# EAGLE design pov-yoyo-0.1 (EAGLE 5.11)
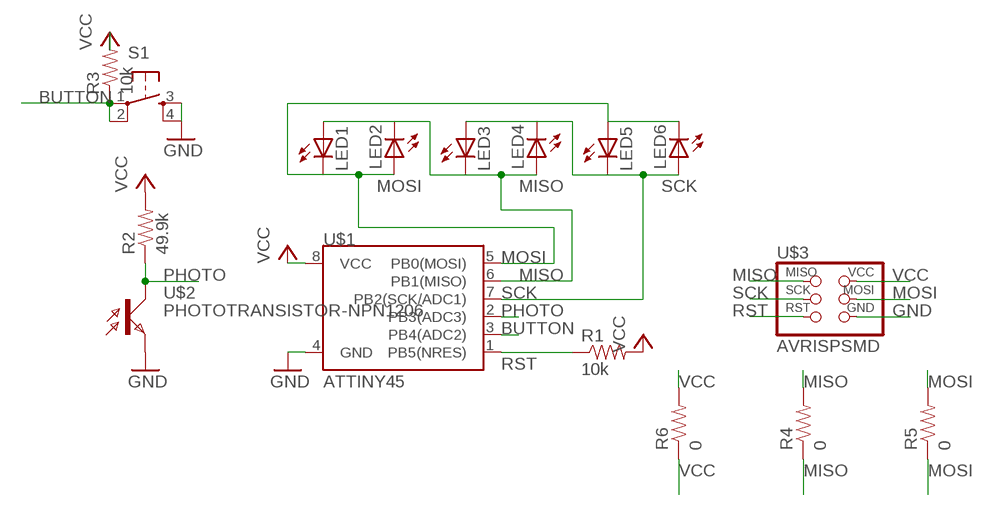
[diagram p0: schematic, sheet 1]

## Parts
LED1  LED1206  [LED-1206]
LED2  LED1206  [LED-1206]
LED3  LED1206  [LED-1206]
LED4  LED1206  [LED-1206]
LED5  LED1206  [LED-1206]
LED6  LED1206  [LED-1206]
R1  10k  RESISTOR1206  [1206]
R2  49.9k  RESISTOR1206  [1206]
R3  10k  RESISTOR1206  [1206]
R4  0  RESISTOR1206  [1206]
R5  0  RESISTOR1206  [1206]
R6  0  RESISTOR1206  [1206]
S1  6MM_SWITCH6MM_SWITCH  [6MM_SWITCH]
U$1  ATTINY45  [SO08-EIAJ]
U$2  PHOTOTRANSISTOR-NPN1206  [OP1206]
U$3  AVRISPSMD  [2X03SMD]

## Nets
BUTTON: R3.1 S1.1(P) S1.2(P1) U$1.3(PB4(ADC2))
GND: S1.3(S) S1.4(S1) U$1.4(GND) U$2.EMITTER(E) U$3.6(GND)
MISO: LED1.A LED2.C LED3.C LED4.A R4.1 R4.2 U$1.6(PB1(MISO)) U$3.1(MISO)
MOSI: LED1.C LED2.A LED5.A LED6.C R5.1 R5.2 U$1.5(PB0(MOSI)) U$3.4(MOSI)
PHOTO: R2.1 U$1.2(PB3(ADC3)) U$2.COLLECTOR(C)
RST: R1.1 U$1.1(PB5(NRES)) U$3.5(RST)
SCK: LED3.A LED4.C LED5.C LED6.A U$1.7(PB2(SCK/ADC1)) U$3.3(SCK)
VCC: R1.2 R2.2 R3.2 R6.1 R6.2 U$1.8(VCC) U$3.2(VCC)

## Library data of the parts
LED1-LED6 = SparkFun:LED: LEDs Standard schematic elements and footprints for 5mm, 3mm, 1206, and 0603 sized LEDs. 5mm - Spark Fun Electronics SKU : COM-00529 (and others)
R1-R6 = SparkFun:RESISTOR: Resistor Basic schematic elements and footprints for 0603, 1206, and PTH resistors.
S1 = fab:6MM_SWITCH: OMRON SWITCH
U$1 = SparkFun:ATTINY45: Atmel ATTiny45
U$2 = fab:PHOTOTRANSISTOR-NPN
U$3 = fab:AVRISP

## Board
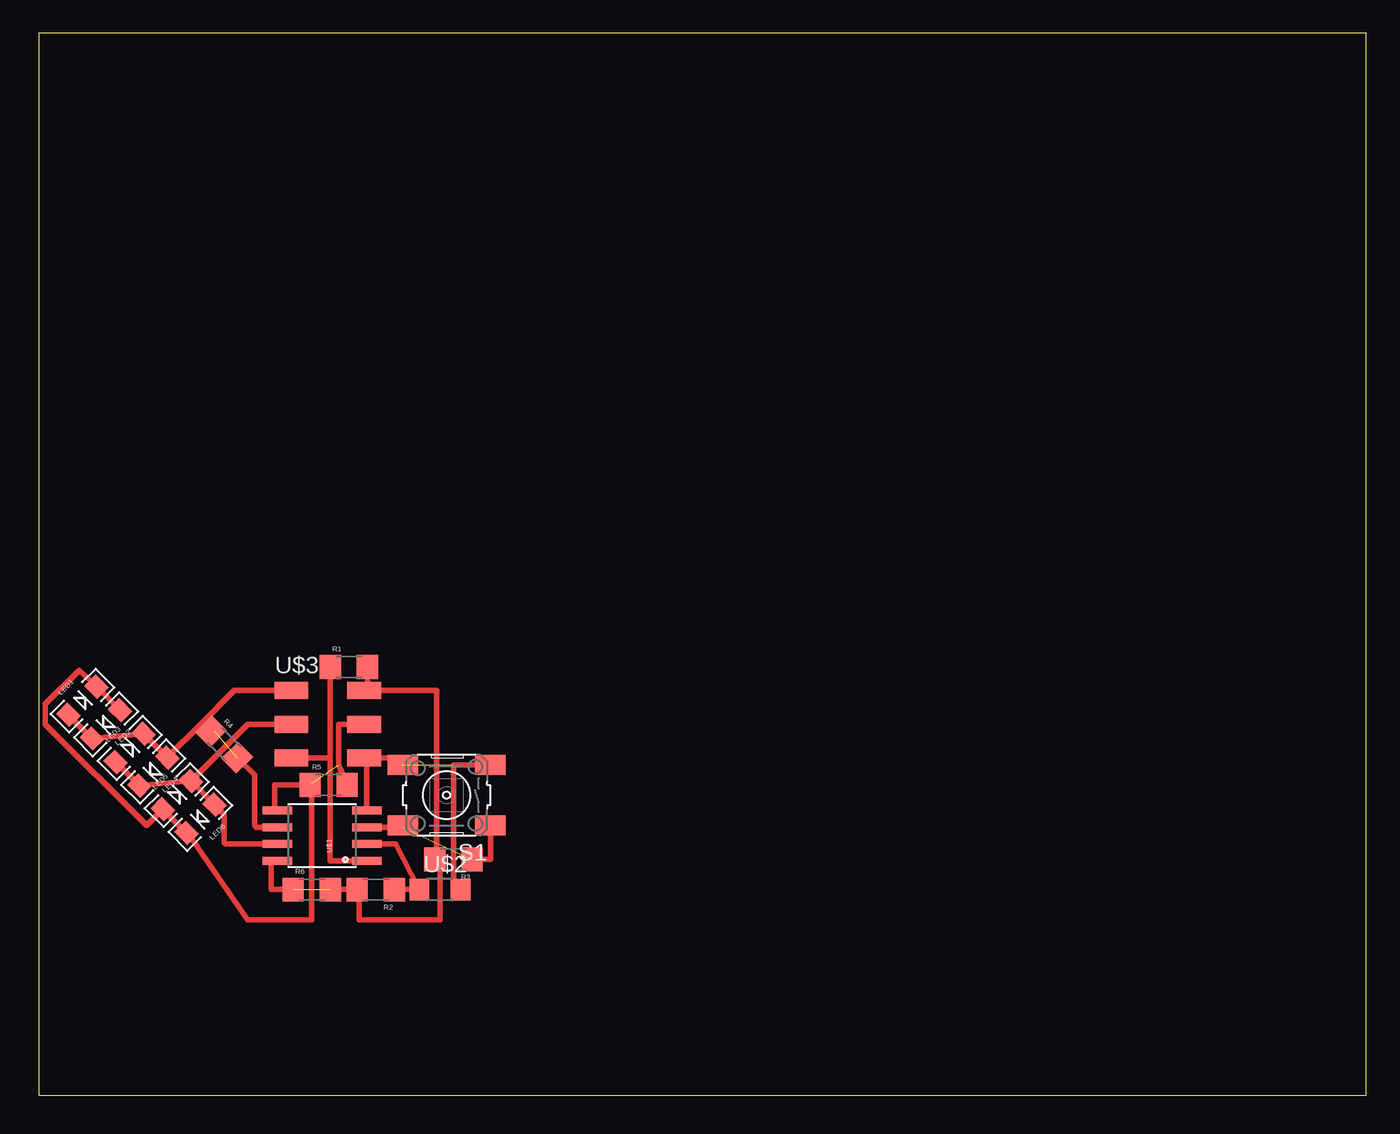
[diagram p1: board, top side]
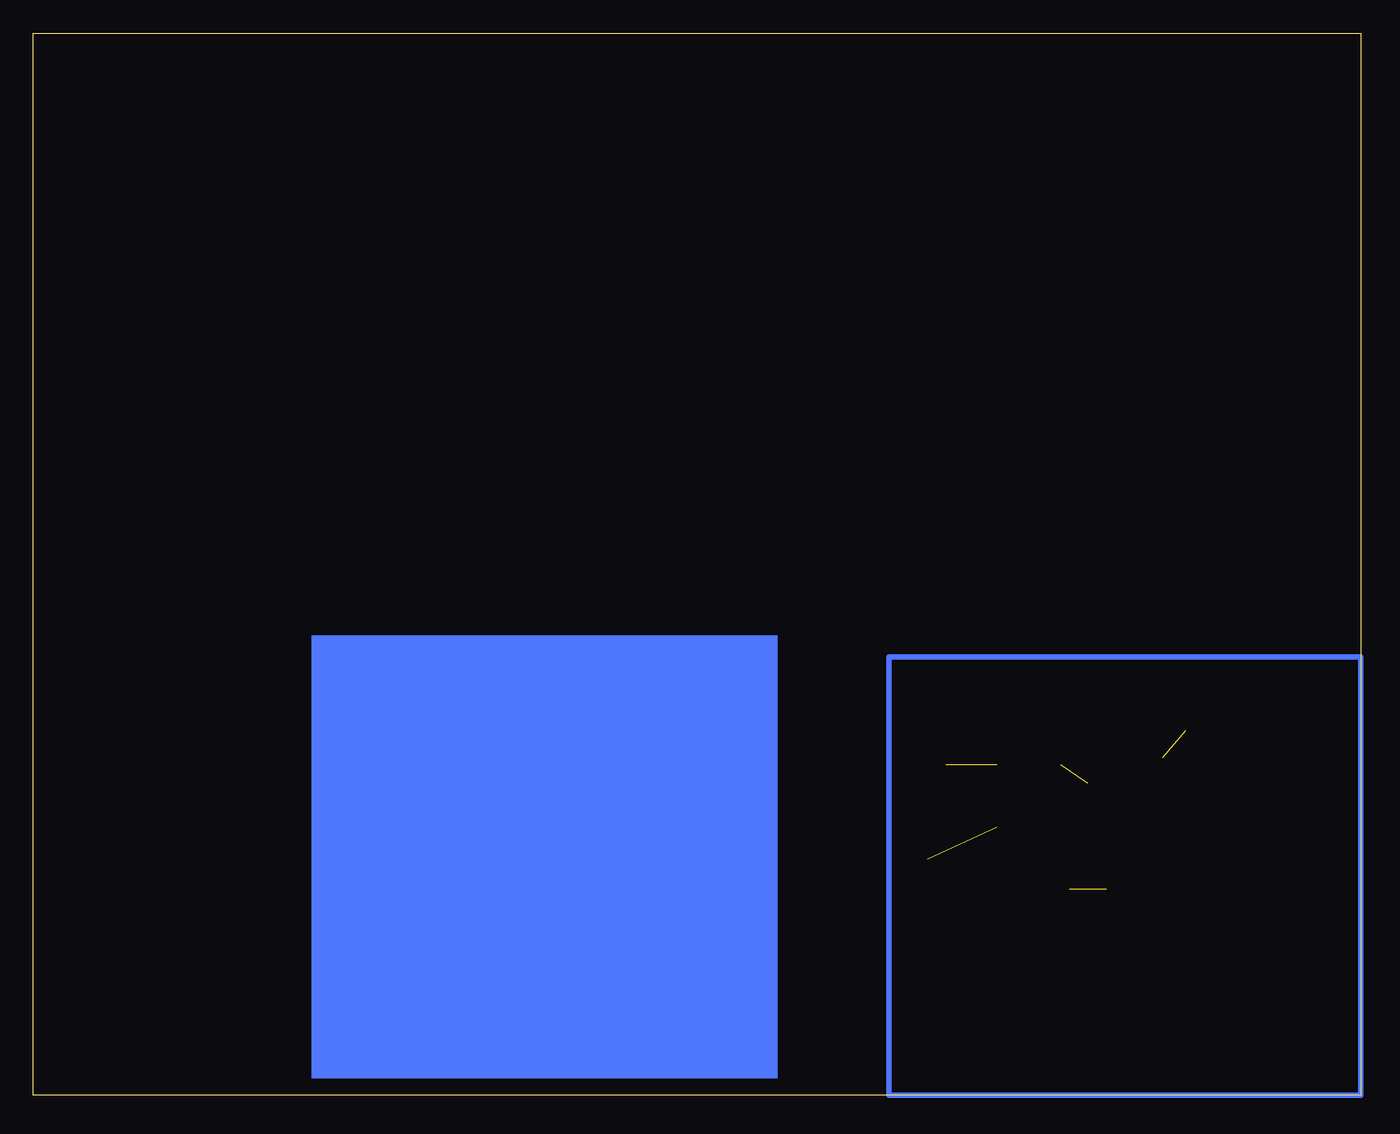
[diagram p2: board, bottom side, seen from below]

Size 100 x 80 mm. Coordinates in mm from the lower left corner, seen from the top.
Outline: 0,0 100,0 100,80 0,80 0,0
Copper layers (1*16): Top 0.035mm / dielectric 1.5mm / Bottom 0.035mm
Design rules "default": minimum track width 10mil, minimum drill 24mil, track to track 8mil, track to pad 8mil, pad to pad 8mil, via to via 8mil, smd to smd 8mil, copper to edge 40mil, drill to drill 8mil, minimum pad ring 10mil, minimum via ring 8mil, stop-mask expansion 4mil, vias tented up to drill 0mil, thermal gap 10mil

### Footprints (pad centres in the part's own frame; a part is rotated, then mirrored left to right if it is on the bottom)
LED-1206 = smd 1.2 x 1.4: A -1.5,0; C 1.5,0
1206 = smd 1.6 x 1.8: 1 -1.4,0; 2 1.4,0
6MM_SWITCH = smd 2.286 x 1.524: 1 -3.302,2.286; 2 3.302,2.286; 3 -3.302,-2.286; 4 3.302,-2.286
SO08-EIAJ = smd 0.61 x 2.21: 1 -1.905,-3.378; 2 -0.635,-3.378; 3 0.635,-3.378; 4 1.905,-3.378; 5 1.905,3.353; 6 0.635,3.353; 7 -0.635,3.353; 8 -1.905,3.353
OP1206 = smd 1.5 x 1.6: COLLECTOR -1.55,0; EMITTER 1.55,0
2X03SMD = smd 2.54 x 1.27: 1 -2.54,2.54; 2 2.92,2.54; 3 -2.54,0; 4 2.92,0; 5 -2.54,-2.54; 6 2.92,-2.54

### Placement (x,y rotation side)
LED1  3.3,29.72 45 top
LED2  5.08,27.94 225 top
LED3  6.86,26.16 45 top
LED4  8.64,24.38 225 top
LED5  10.41,22.61 45 top
LED6  12.19,20.83 225 top
R1  23.37,32.26 0 top
R2  25.4,15.49 180 top
R3  31.24,17.78 180 top
R4  13.97,26.42 315.1 top
R5  21.84,23.37 0 top
R6  20.57,15.49 0 top
S1  30.73,22.61 180 top
U$1  21.34,19.56 90 top
U$2  30.23,15.49 0 top
U$3  21.59,27.94 0 top

### Tracks (layer width: path | path; a pad name or v marks a point on that pad's centre or on a via)
BUTTON  (1 unrouted)
  Top 0.406: R3.1 34.04,17.78 S1.1 | U$1.3 27.43,20.19 S1.2
GND  (1 unrouted)
  Top 0.406: S1.4 27.43,25.4 U$3.6 24.71,25.4 U$1.4 | U$2.EMITTER 31.24,15.49 31.24,24.89 S1.3
MISO  (1 unrouted)
  Top 0.406: LED1.A LED2.C LED3.C LED4.A 12.19,27.94 | R4.1 13.01,27.43 13.21,27.43 12.19,27.94 | R4.2 16.26,24.13 16.26,20.32 16.38,20.19 U$1.6 | 12.19,27.94 14.73,30.48 U$3.1
MOSI  (1 unrouted)
  Top 0.406: 6.35,29.21 LED2.A LED1.C 3.05,32 0.51,29.46 0.51,27.94 8.13,20.32 LED5.A LED6.C 11.22,19.77 15.75,13.21 20.57,13.21 20.57,23.49 R5.1 17.78,23.37 17.78,21.46 U$1.5 | R5.2 22.61,24.89 22.61,27.94 U$3.4
N$1
  Bottom 0.406: 0,0 35.56,0 35.56,33.02 0,33.02 0,0
PHOTO
  Top 0.406: U$1.2 26.9,18.92 U$2.COLLECTOR R2.1
RST
  Top 0.406: U$1.1 21.97,17.65 21.97,25.4 | 21.97,25.4 R1.1 | 21.97,25.4 U$3.5
SCK
  Top 0.406: LED3.A LED4.C LED5.C | LED5.C LED6.A 13.97,21.17 13.97,19.05 14.1,18.92 U$1.7 | U$3.3 15.75,27.94 LED5.C
VCC  (1 unrouted)
  Top 0.406: 17.78,17.65 U$1.8 17.53,17.65 17.53,15.49 R6.1 | R6.2 R2.2 24.13,15.49 24.13,13.21 30.23,13.21 30.23,17.78 R3.2 29.97,17.78 29.97,30.48 U$3.2 24.77,30.48 R1.2
(copper drawn outside any net)
  shapes: Bottom area x1